# Altium schematic sheet STM32.SchDoc
size A; SheetNumber: 1; SheetTotal: 1
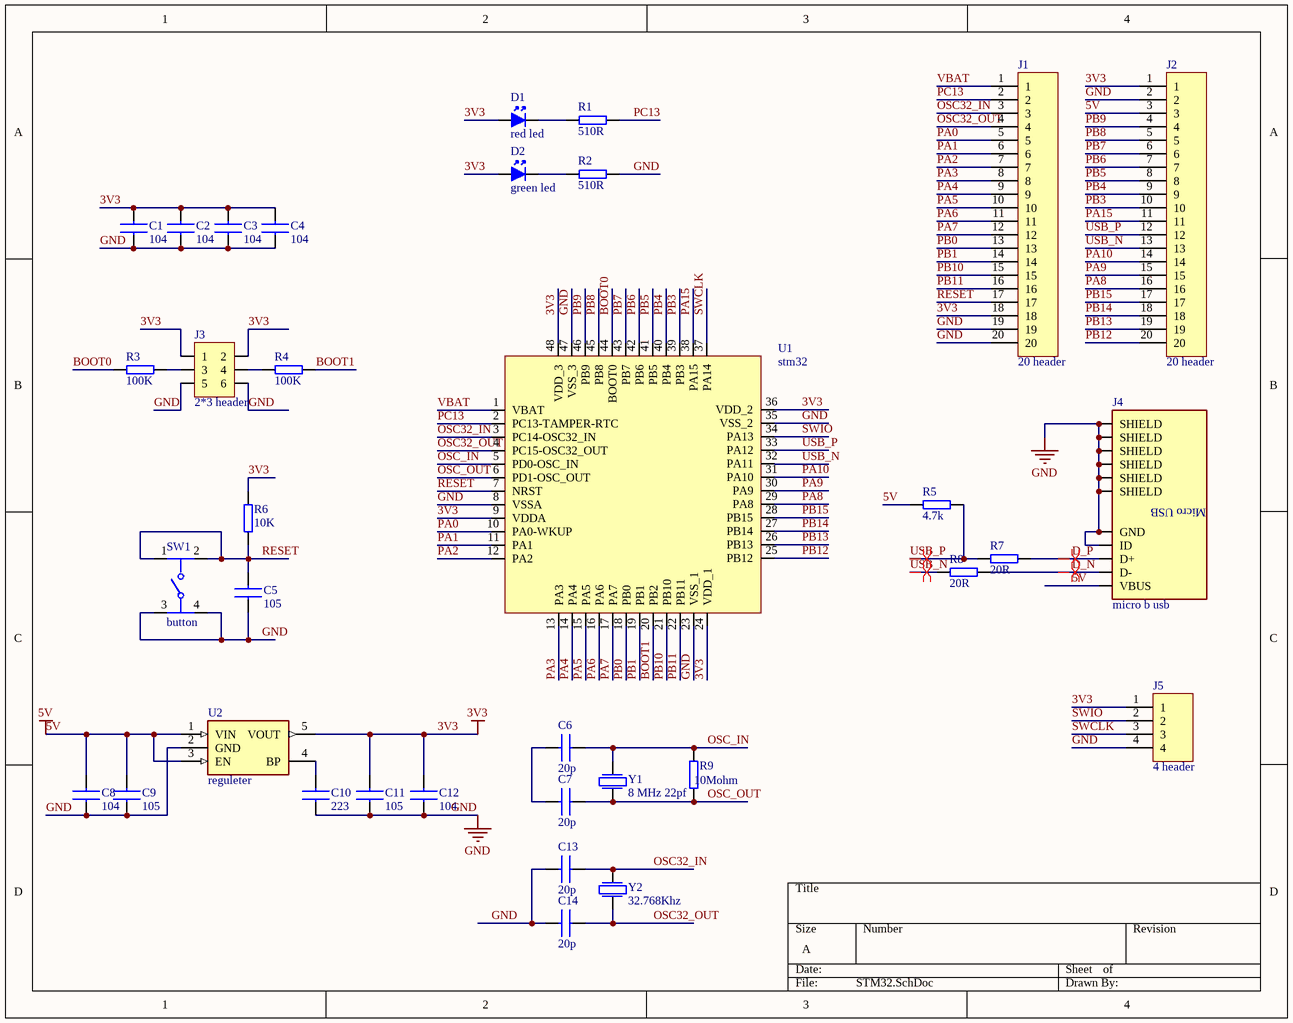
[diagram p0: STM32.SchDoc]

## Parts
C1  104  [cap 0603]
C2  104  [cap 0603]
C3  104  [cap 0603]
C4  104  [cap 0603]
C5  105  [cap 0603]
C6  20p  [cap 0603]
C7  20p  [cap 0603]
C8  104  [cap 0603]
C9  105  [CAP 0805]
C10  223  [cap 0603]
C11  105  [CAP 0805]
C12  104  [cap 0603]
C13  20p  [cap 0603]
C14  20p  [cap 0603]
D1  red led  [red led]
D2  green led  [led green]
J1  20 header  [20*1 header]
J2  20 header  [20*1 header]
J3  2*3 header  [2*3 header]
J4  micro b usb  [micro-b usb]
J5  4 header  [4 header]
R1  510R  [res 0603]
R2  510R  [res 0603]
R3  100K  [res 0603]
R4  100K  [res 0603]
R5  4.7k  [res 0603]
R6  10K  [res 0603]
R7  20R  [res 0603]
R8  20R  [res 0603]
R9  10Mohm  [res 0603]
SW1  button  [button]
U1  stm32  [stm32]
U2  reguleter  [reguleter]
Y1  8 MHz 22pf  [8MHz cristal]
Y2  32.768Khz  [32.768KHZ]

## Nets
3V3: C1.2 C2.2 C3.2 C4.2 C11.2 C12.2 D1.2 D2.2 J1.18 J2.1 J3.1 J3.2 J5.1 R6.2 U1.9(VDDA) U1.24(VDD_1) U1.36(VDD_2) U1.48(VDD_3) U2.5(VOUT)
5V: C8.2 C9.2 J2.3 J4.1(VBUS) R5.1 U2.1(VIN) U2.3(EN)
GND: C1.1 C2.1 C3.1 C4.1 C5.1 C8.1 C9.1 C10.1 C11.1 C12.1 C13.1 C14.1 J1.19 J1.20 J2.2 J3.5 J3.6 J4.4(ID) J4.5(GND) J4.SH1(SHIELD) J4.SH2(SHIELD) J4.SH3(SHIELD) J4.SH4(SHIELD) J4.SH5(SHIELD) J4.SH6(SHIELD) J5.4 R2.2 SW1.3 SW1.4 U1.8(VSSA) U1.23(VSS_1) U1.35(VSS_2) U1.47(VSS_3) U2.2(GND)
BOOT0: R3.1 U1.44(BOOT0)
BOOT1: R4.2 U1.20(PB2)
D_N: J4.2(D-) R8.2
D_P: J4.3(D+) R7.2
OSC32_IN: C13.2 J1.3 U1.3(PC14-OSC32_IN) Y2.2
OSC32_OUT: C14.2 J1.4 U1.4(PC15-OSC32_OUT) Y2.1
OSC_IN: C6.2 R9.2 U1.5(PD0-OSC_IN) Y1.2
OSC_OUT: C7.2 R9.1 U1.6(PD1-OSC_OUT) Y1.1
PA0: J1.5 U1.10(PA0-WKUP)
PA1: J1.6 U1.11(PA1)
PA2: J1.7 U1.12(PA2)
PA3: J1.8 U1.13(PA3)
PA4: J1.9 U1.14(PA4)
PA5: J1.10 U1.15(PA5)
PA6: J1.11 U1.16(PA6)
PA7: J1.12 U1.17(PA7)
PA8: J2.16 U1.29(PA8)
PA9: J2.15 U1.30(PA9)
PA10: J2.14 U1.31(PA10)
PA15: J2.11 U1.38(PA15)
PB0: J1.13 U1.18(PB0)
PB1: J1.14 U1.19(PB1)
PB3: J2.10 U1.39(PB3)
PB4: J2.9 U1.40(PB4)
PB5: J2.8 U1.41(PB5)
PB6: J2.7 U1.42(PB6)
PB7: J2.6 U1.43(PB7)
PB8: J2.5 U1.45(PB8)
PB9: J2.4 U1.46(PB9)
PB10: J1.15 U1.21(PB10)
PB11: J1.16 U1.22(PB11)
PB12: J2.20 U1.25(PB12)
PB13: J2.19 U1.26(PB13)
PB14: J2.18 U1.27(PB14)
PB15: J2.17 U1.28(PB15)
PC13: J1.2 R1.2 U1.2(PC13-TAMPER-RTC)
RESET: C5.2 J1.17 R6.1 SW1.1 SW1.2 U1.7(NRST)
SWCLK: J5.3 U1.37(PA14)
SWIO: J5.2 U1.34(PA13)
USB_N: J2.13 R8.1 U1.32(PA11)
USB_P: J2.12 R5.2 R7.1 U1.33(PA12)
VBAT: J1.1 U1.1(VBAT)
NetC6_1: C6.1 C7.1
NetC10_2: C10.2 U2.4(BP)
NetD1_1: D1.1 R1.1
NetD2_1: D2.1 R2.1
NetJ3_3: J3.3 R3.2
NetJ3_4: J3.4 R4.1

## Layout directives
differential pair: D_N, D_P, USB_N, USB_P

## Notes on the sheet
- (in symbol micro-b usb) Micro USB

## Library data of the parts
C1-C4 C8 C12 = 104,0603: 0603
C5 = 105,0603: 0603
C6 C7 C13 C14 = 20p,0603: 0603
C9 C11 = 105,0805: 0805
C10 = 223,0603: 0603
J4 = micro-b usb
R1 R2 = 510R: 0603
R3 R4 = 100K: 0603
R5 = 4.7k,0603: 0603
R6 = 10K: 0603
R7 R8 = 20R: 0603
R9 = 10Mohm: 10 MOhms ±5% 0.125W, 1/8W Chip Resistor 0805 (2012 Metric) High Voltage, Non-Magnetic Thick Film; digkey: 696-HVS0805-10MJ1CT-ND; JLCPCB Part #: C4095037
SW1 = push button: Keypad Switch, 0.05A, 12VDC, 2.55N, , Surface Mount-straight; Manufacturer: ITT C&K; Manufacturer Part Number: PTS645SK43SMTR92LFS; Manufacturer Series: PTS645; Contact Current(DC)-Max: 50mA; Contact DC Max Rating R Load: 0.05A@12VDC; Contact Resistance: 0.1mR; Contact Voltage(DC)-Max: 12V; Dielectric Withstand Volts: 250VACV; Insulation Resistance: 100GR; PCB Hole Count: 4; Switch Action: MOMENTARY; Switch Function: SPST; Body Breadth: 5.9944mm; Body Height: 3.4544mm; Supplier: Digikey; Supplier Part Number: CKN9084CT-ND; RoHS: Yes; Category: Tactile Switches; Stock: 133695; Pricing: 1=0.32, 10=0.275, 25=0.2576, 100=0.2307, 250=0.2138, 500=0.20176 (USD); Mounting Technology: Surface Mount; Terminal Finish: Silver; Min Operating Temperature: -20°C; Max Operating Temperature: 60°C; JESD-609 Code: e4; Actuator Type: Pushbutton; Switch Type: Keypad; Termination: Solder; Body Length or Diameter: 5.9944mm; Terminal Length: 0.138inch; Reach SVHC Compliant: Yes; RoHS Compliant: Yes; ComponentLink1URL: https://datasheet.ciiva.com:443/pdfs/VipMasterIC/IC/CKCI/CKCI-S-A0001796527/CKCI-S-A0001796842-1.pdf?src-supplier=IHS+Markit; ComponentLink1Description: https://datasheet.ciiva.com:443/pdfs/VipMasterIC/IC/CKCI/CKCI-S-A0001796527/CKCI-S-A0001796842-1.pdf?src-supplier=IHS+Markit; ComponentLink2URL: https://datasheet.ciiva.com/14920/pts645-9sept14-14920736.pdf?src-supplier=Digikey; ComponentLink2Description: https://datasheet.ciiva.com/14920/pts645-9sept14-14920736.pdf?src-supplier=Digikey; ComponentLink3URL: https://datasheet.ciiva.com/29903/getdatasheetpartid-790637-29903897.pdf?src-supplier=Verical; ComponentLink3Description: https://datasheet.ciiva.com/29903/getdatasheetpartid-790637-29903897.pdf?src-supplier=Verical; ComponentLink4URL: https://datasheet.ciiva.com/22637/1707731-22637357.pdf?src-supplier=Element14; ComponentLink4Description: https://datasheet.ciiva.com/22637/1707731-22637357.pdf?src-supplier=Element14; LCSC part Number: C221871
U2 = reguleter: Linear Voltage Regulator IC Positive Fixed 1 Output 300mA TSOT-23-5; MP: RT9193-33GB; MF: Richtek USA; SnapEDA_Link: https://www.snapeda.com/parts/RT9193-33GB/Richtek+USA+Inc./view-part/?ref=snap; Package: SOT-23-5 Richtek; Check_prices: https://www.snapeda.com/parts/RT9193-33GB/Richtek+USA+Inc./view-part/?ref=eda; Purchase-URL: https://pricing.snapeda.com/search/part/RT9193-33GB/?ref=eda; Digi-Key_Part_Number: 1028-1014-2-ND; Value: *
Y1 = 8 MHz 22pf: 8 MHz ±30ppm Crystal 22pF 80 Ohms HC-49/US; digkey: 9C-8.000MAAL-T-ND; JLCPCB Part #: C6109242